# EAGLE design W040A (EAGLE 6.6.0)
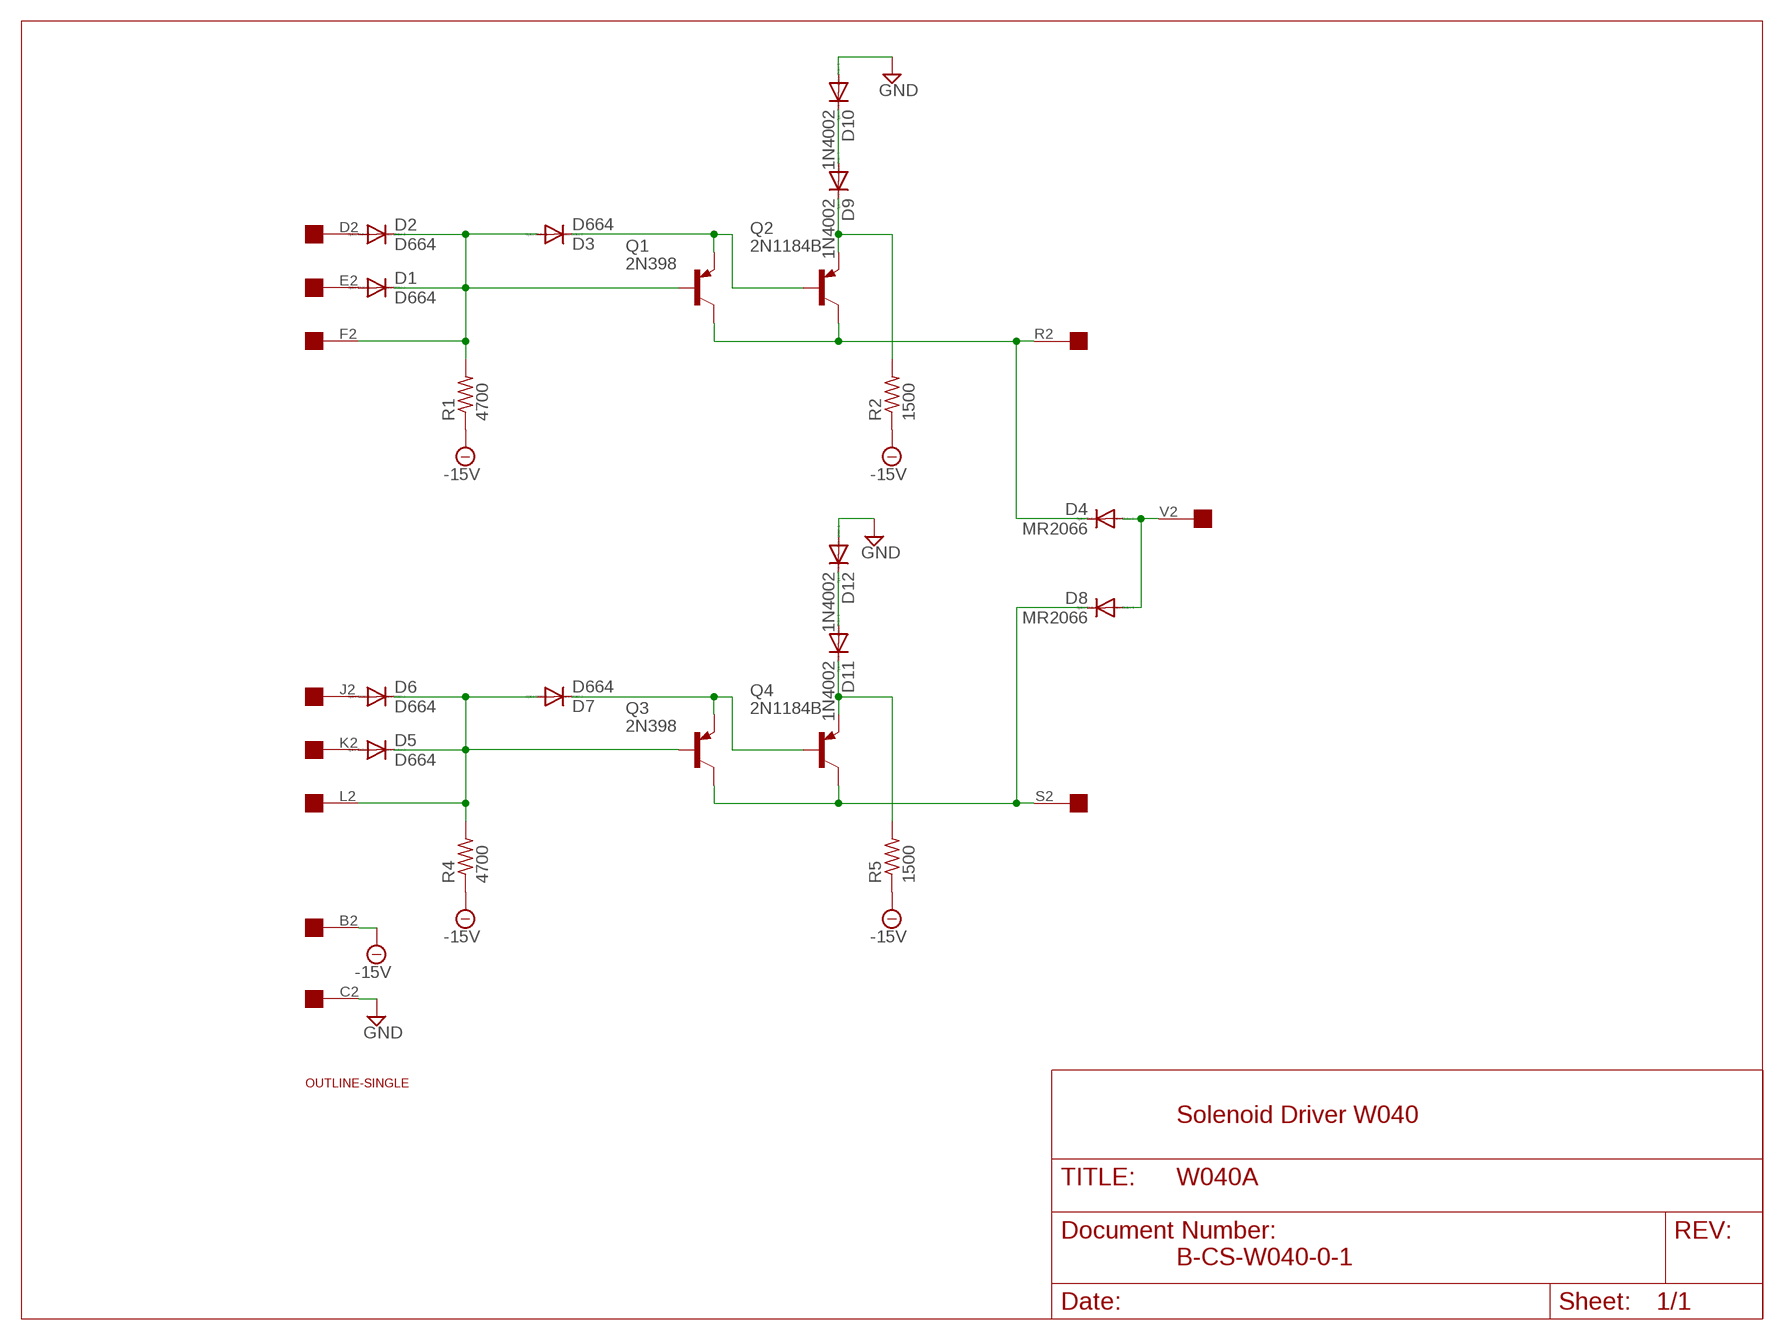
[diagram p0: schematic, sheet 1]

## Parts
D1  D664  1N4148DO35-10  [DO35-10]
D2  D664  1N4148DO35-10  [DO35-10]
D3  D664  1N4148DO35-10  [DO35-10]
D4  MR2066  1N4004  [DO41-10]
D5  D664  1N4148DO35-10  [DO35-10]
D6  D664  1N4148DO35-10  [DO35-10]
D7  D664  1N4148DO35-10  [DO35-10]
D8  MR2066  1N4004  [DO41-10]
D9  1N4002  1N4004  [DO41-10]
D10  1N4002  1N4004  [DO41-10]
D11  1N4002  1N4004  [DO41-10]
D12  1N4002  1N4004  [DO41-10]
Q1  2N398  2N2904  [TO39]
Q2  2N1184B  2N2905  [TO5]
Q3  2N398  2N2904  [TO39]
Q4  2N1184B  2N2905  [TO5]
R1  4700  R-US_0207/10  [0207/10]
R2  1500  R-US_0207/10  [0207/10]
R4  4700  R-US_0207/10  [0207/10]
R5  1500  R-US_0207/10  [0207/10]
U$1  OUTLINE-SINGLE  [SINGLE]
U$2  EDGE-1  [EDGE-CON1]

## Nets
-15V: R1.1 R2.1 R4.1 R5.1 U$2.B2
GND: D10.A D12.A U$2.C2
N$1: D1.A U$2.E2
N$2: D2.A U$2.D2
N$3: D1.C D2.C D3.A Q1.2(B) R1.2 U$2.F2
N$4: D3.C Q1.1(E) Q2.2(B)
N$5: D9.A D10.C
N$6: D4.A D8.A U$2.V2
N$7: D4.C Q1.3(C) Q2.3(C) U$2.R2
N$8: D5.A U$2.K2
N$9: D6.A U$2.J2
N$10: D5.C D6.C D7.A Q3.2(B) R4.2 U$2.L2
N$11: D7.C Q3.1(E) Q4.2(B)
N$12: D9.C Q2.1(E) R2.2
N$13: D8.C Q3.3(C) Q4.3(C) U$2.S2
N$14: D11.C Q4.1(E) R5.2
N$15: D11.A D12.C
Unconnected: U$2.A2 U$2.H2 U$2.M2 U$2.N2 U$2.P2 U$2.T2 U$2.U2

## Notes on the sheet
- Solenoid Driver W040
- B-CS-W040-0-1

## Library data of the parts
D1-D3 D5-D7 = diode:1N4148: DIODE high speed (Philips)
D4 D8-D12 = diode:1N4004: DIODE general purpose rectifier, 1 A
Q1 Q3 = transistor-pnp:2N2904*: PNP Transistror
Q2 Q4 = transistor-pnp:2N2905: PNP Transistor
R1 R2 R4 R5 = rcl:R-US_: RESISTOR, American symbol
U$1 = dec-con:OUTLINE-*: Board outlines for DEC boards.
U$2 = dec-con:EDGE-1: Single-Sided DEC Edge Connector -- (side 2)

## Net classes
1 Supply: width 0.813 mm

## Board
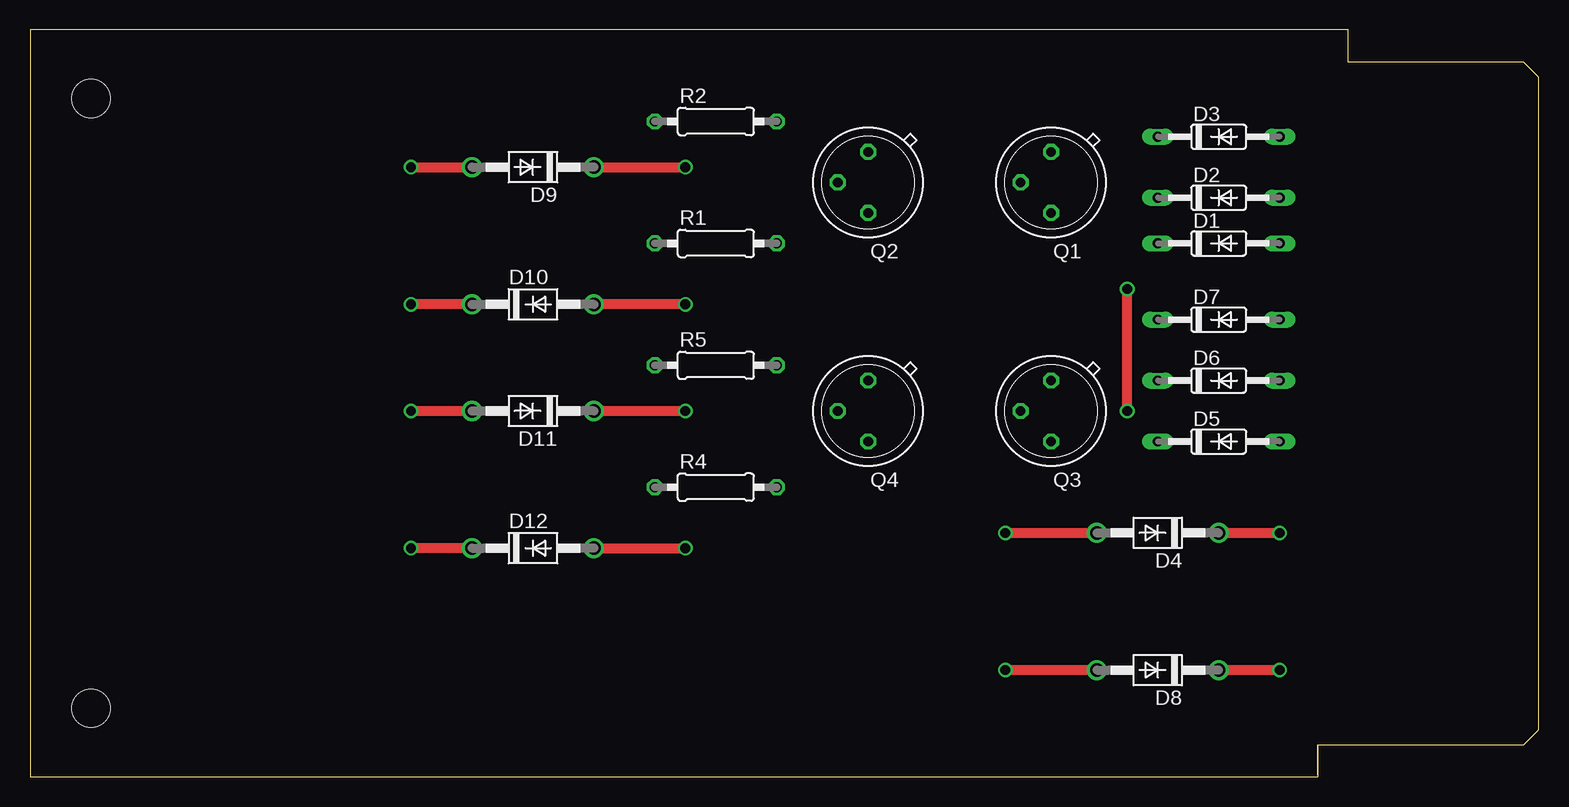
[diagram p1: board, top side]
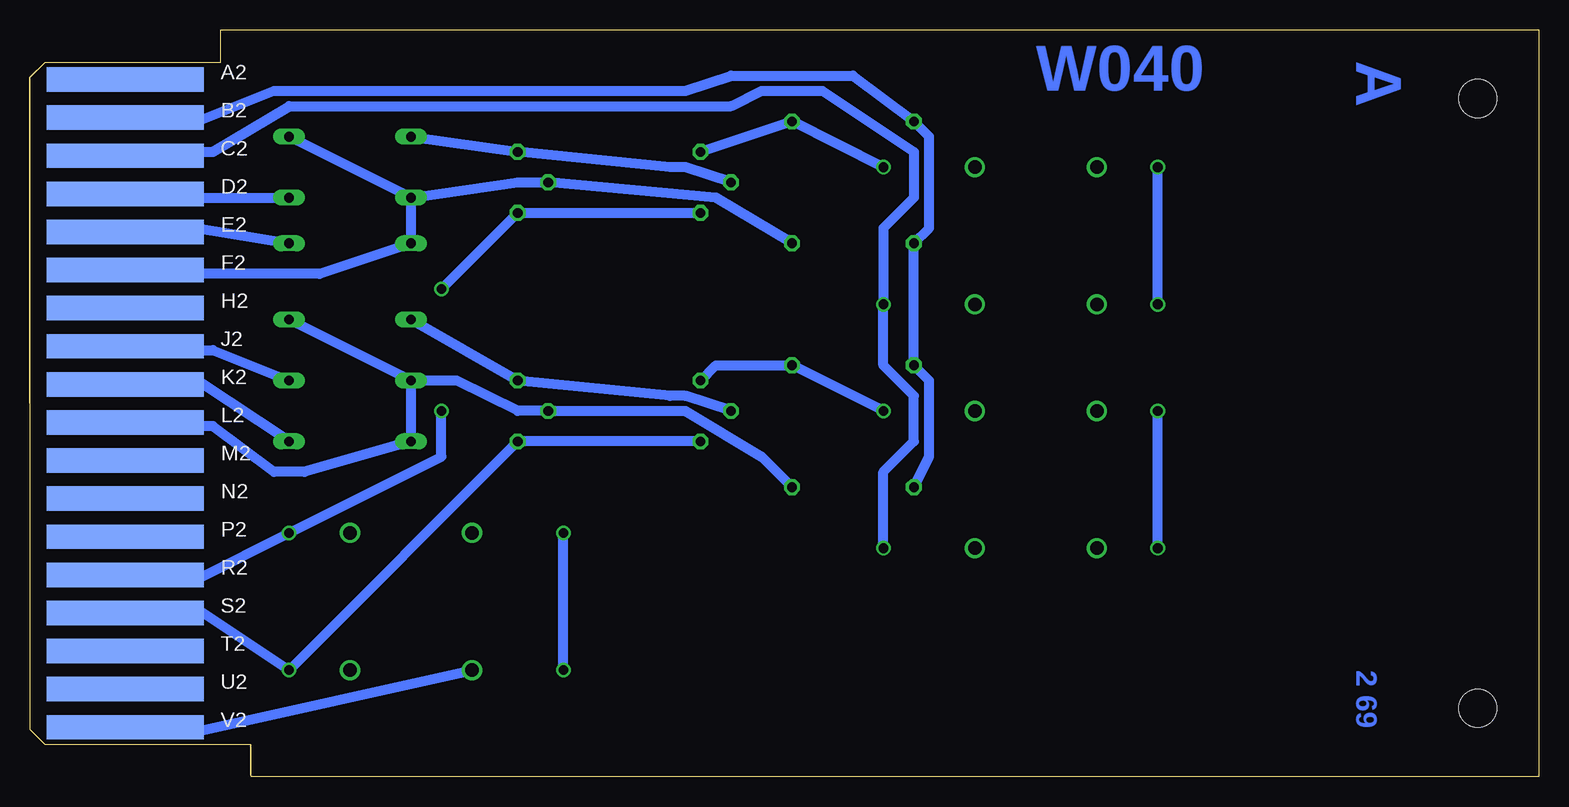
[diagram p2: board, bottom side, seen from below]

Size 125.73 x 62.23 mm. Coordinates in mm from the lower left corner, seen from the top.
Copper layers (1+16): Top 0.035mm / dielectric 1.5mm / Bottom 0.035mm
Design rules "16mils": minimum track width 16mil, minimum drill 32mil, track to track 15mil, track to pad 10mil, pad to pad 10mil, via to via 10mil, smd to smd 10mil, copper to edge 13mil, drill to drill 10mil, minimum pad ring 10mil, minimum via ring 8mil, stop-mask expansion 0mil, vias tented up to drill 0mil, thermal gap 10mil

### Footprints (pad centres in the part's own frame; a part is rotated, then mirrored left to right if it is on the bottom)
DO35-10 = drill 0.813 long: A 5.08,0; C -5.08,0
DO41-10 = drill 1.118: A 5.08,0; C -5.08,0
TO39 = drill 0.813 octagon: 1 0,-2.54; 2 2.54,0; 3 0,2.54
TO5 = drill 0.813 octagon: 1 0,-2.54; 2 2.54,0; 3 0,2.54
0207/10 = drill 0.813 octagon: 1 -5.08,0; 2 5.08,0
SINGLE = hole 3.175: 120.65,56.515; 120.65,5.715
EDGE-CON1 = smd 13.106 x 2.032 bottom: A2 7.938,4.128; B2 7.938,7.303; C2 7.938,10.477; D2 7.938,13.652; E2 7.938,16.828; F2 7.938,20.003; H2 7.938,23.177; J2 7.938,26.352; K2 7.938,29.527; L2 7.938,32.703; M2 7.938,35.877; N2 7.938,39.053; P2 7.938,42.227; R2 7.938,45.403; S2 7.938,48.578; T2 7.938,51.752; U2 7.938,54.928; V2 7.938,58.102

### Placement (x,y rotation side)
D1  99.06,44.45 0 top
D2  99.06,48.26 0 top
D3  99.06,53.34 0 top
D4  93.98,20.32 180 top
D5  99.06,27.94 0 top
D6  99.06,33.02 0 top
D7  99.06,38.1 0 top
D8  93.98,8.89 180 top
D9  41.91,50.8 180 top
D10  41.91,39.37 0 top
D11  41.91,30.48 180 top
D12  41.91,19.05 0 top
Q1  85.09,49.53 180 top
Q2  69.85,49.53 180 top
Q3  85.09,30.48 180 top
Q4  69.85,30.48 180 top
R1  57.15,44.45 0 top
R2  57.15,54.61 0 top
R4  57.15,24.13 0 top
R5  57.15,34.29 0 top
U$1  125.73,62.23 180 top
U$2  125.73,62.23 180 top

### Tracks (layer width: path | path; a pad name or v marks a point on that pad's centre or on a via)
-15V
  Bottom 0.813: R4.1 50.8,26.67 50.8,33.02 R5.1 R1.1 50.8,45.72 50.8,53.34 R2.1 57.15,58.42 67.31,58.42 71.12,57.15 105.41,57.15 111.76,54.61 116.84,54.61 U$2.B2
GND  (via drill 0.81)
  Top 0.813: D12.A v54.61,19.05 | v54.61,39.37 D10.A
  Bottom 0.813: U$2.C2 118.11,52.07 110.49,52.07 104.14,55.88 67.31,55.88 64.77,57.15 59.69,57.15 52.07,52.07 52.07,48.26 54.61,45.72 v54.61,39.37 54.61,34.29 52.07,31.75 52.07,27.94 54.61,25.4 v54.61,19.05
N$1
  Bottom 0.813: U$2.E2 116.84,45.72 111.76,45.72 D1.A
N$2
  Bottom 0.813: U$2.D2 116.84,48.26 D2.A
N$3
  Bottom 0.813: R1.2 68.58,48.26 Q1.2 85.09,49.53 D2.C | D2.C D1.C 101.6,41.91 116.84,41.91 U$2.F2 | D2.C D3.A
N$4
  Bottom 0.813: Q2.2 71.12,50.8 72.39,50.8 Q1.1 D3.C
N$5  (via drill 0.81)
  Top 0.813: D10.C v31.75,39.37 | v31.75,50.8 D9.A
  Bottom 0.813: v31.75,39.37 v31.75,50.8
N$6  (via drill 0.81)
  Top 0.813: D8.A v81.28,8.89 | v81.28,20.32 D4.A
  Bottom 0.813: U$2.V2 118.11,4.13 118.11,3.81 111.76,3.81 D8.A | v81.28,8.89 v81.28,20.32
N$7  (via drill 0.81)
  Top 0.813: D4.C v104.14,20.32 | v91.44,30.48 v91.44,40.64
  Bottom 0.813: U$2.R2 116.84,16.51 111.76,16.51 v104.14,20.32 91.44,26.67 v91.44,30.48 | v91.44,40.64 Q1.3 Q2.3
N$8
  Bottom 0.813: U$2.K2 116.84,33.02 111.76,33.02 D5.A
N$9
  Bottom 0.813: U$2.J2 116.84,35.56 110.49,35.56 D6.A
N$10
  Bottom 0.813: R4.2 64.77,26.67 71.12,30.48 Q3.2 85.09,30.48 90.17,33.02 D6.C | D6.C D5.C 102.87,25.4 105.41,25.4 110.49,29.21 116.84,29.21 U$2.L2 | D6.C D7.A
N$11
  Bottom 0.813: Q4.2 71.12,31.75 72.39,31.75 Q3.1 D7.C
N$12  (via drill 0.81)
  Top 0.813: D9.C v54.61,50.8
  Bottom 0.813: Q2.1 R2.2 v54.61,50.8
N$13  (via drill 0.81)
  Top 0.813: v104.14,8.89 D8.C
  Bottom 0.813: U$2.S2 118.11,13.97 111.76,13.97 v104.14,8.89 Q3.3 Q4.3
N$14  (via drill 0.81)
  Top 0.813: D11.C v54.61,30.48
  Bottom 0.813: Q4.1 68.58,34.29 R5.2 v54.61,30.48
N$15  (via drill 0.81)
  Top 0.813: D12.C v31.75,19.05 | v31.75,30.48 D11.A
  Bottom 0.813: v31.75,19.05 v31.75,30.48

### Text on the board
Bottom: A | W040 | 2 69